# EAGLE design CubeSatPowerSupply (EAGLE 6.2)
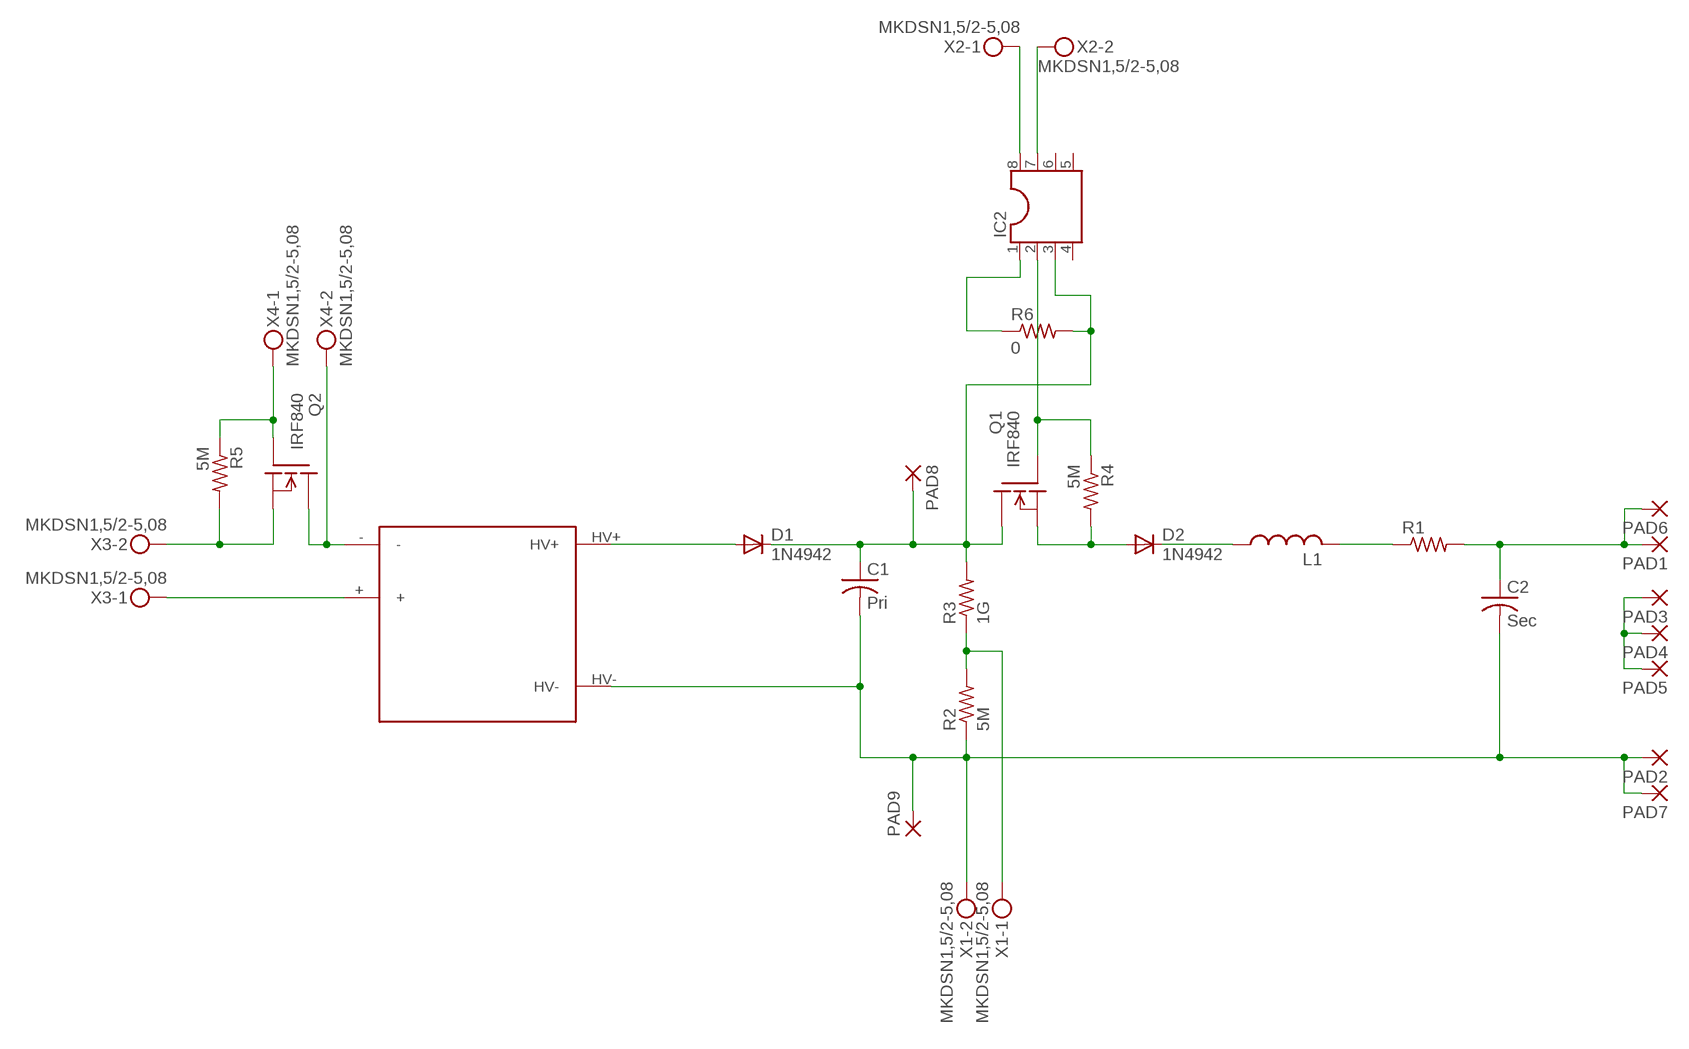
[diagram p0: schematic, sheet 1]

## Parts
C1  Pri  C-US325-182X374  [C325-182X374]
C2  Sec  C-US325-182X374  [C325-182X374]
D1  1N4942  [DO41-10]
D2  1N4942  [DO41-10]
IC2  DIL8  [DIL08]
L1  L-US0207/12  [0207/12]
PAD1  2,54/1,0  [2,54/1,0]
PAD2  2,54/1,0  [2,54/1,0]
PAD3  2,54/1,0  [2,54/1,0]
PAD4  2,54/1,0  [2,54/1,0]
PAD5  2,54/1,0  [2,54/1,0]
PAD6  2,54/1,0  [2,54/1,0]
PAD7  2,54/1,0  [2,54/1,0]
PAD8  2,54/1,0  [2,54/1,0]
PAD9  2,54/1,0  [2,54/1,0]
Q1  IRF840  [TO220]
Q2  IRF840  [TO220]
R1  R-US_0309/12  [0309/12]
R2  5M  R-US_0207/10  [0207/10]
R3  1G  R-US_0207/10  [0207/10]
R4  5M  R-US_0207/10  [0207/10]
R5  5M  R-US_0207/10  [0207/10]
R6  0  R-US_0207/10  [0207/10]
U$1  Q5  [Q5]
X1  MKDSN1,5/2-5,08  [MKDSN1,5/2-5,08]
X2  MKDSN1,5/2-5,08  [MKDSN1,5/2-5,08]
X3  MKDSN1,5/2-5,08  [MKDSN1,5/2-5,08]
X4  MKDSN1,5/2-5,08  [MKDSN1,5/2-5,08]

## Nets
N$1: L1.2 R1.1
N$2: D2.C L1.1
N$3: C2.1 PAD1.1(P) PAD6.1(P) R1.2
N$4: IC2.2 Q1.1(G) R4.1
N$5: D2.A Q1.3(S) R4.2
N$6: C1.1 D1.C IC2.3 PAD8.1(P) Q1.2(D) R3.2 R6.2
N$7: IC2.1 R6.1
N$8: Q2.1(G) R5.1 X4.1
N$10: D1.A U$1.HV+
N$11: R2.2 R3.1 X1.1
N$12: C1.2 C2.2 PAD2.1(P) PAD7.1(P) PAD9.1(P) R2.1 U$1.HV- X1.2
N$13: PAD3.1(P) PAD4.1(P) PAD5.1(P)
N$17: IC2.7 X2.2
N$18: IC2.8 X2.1
N$19: Q2.3(S) R5.2 X3.2
N$20: Q2.2(D) U$1.- X4.2
N$21: U$1.+ X3.1
Unconnected: IC2.4 IC2.5 IC2.6

## Library data of the parts
C1 C2 = rcl:C-US: CAPACITOR, American symbol
D1 D2 = diode:1N4942: DIODE 1.0 A, 200 V, 150 ns
IC2 = ic-package:DIL8: Dual In Line / Socket
L1 = rcl:L-US: INDUCTOR, American symbol
PAD1-PAD9 = wirepad:2,54/1,0: THROUGH-HOLE PAD
Q1 Q2 = transistor-fet:IRF840: N-Channel Enhancement MOSFET (HEXFET); 500V; 8A; 0,85Ohm
R1-R6 = rcl:R-US_: RESISTOR, American symbol
U$1 = CubeSat:Q5
X1-X4 = con-phoenix-508:MKDSN1,5/2-5,08: MKDSN 1,5/ 2-5,08 Printklemme Nennstrom: 13,5 A Nennspannung: 250 V Rastermaß: 5,08 mm Polzahl: 2 Anschlussart: Schraubanschluss Montage: Löten Anschlussrichtung Leiter/Platine: 0 ° Artikelnummer: 1729128 Source: http://eshop.phoenixcontact.com .. 1729128.pdf; MPN: MKDSN 1,5/2-5.08; OC_FARNELL: 1792903; OC_NEWARK: 30M2397

## Board
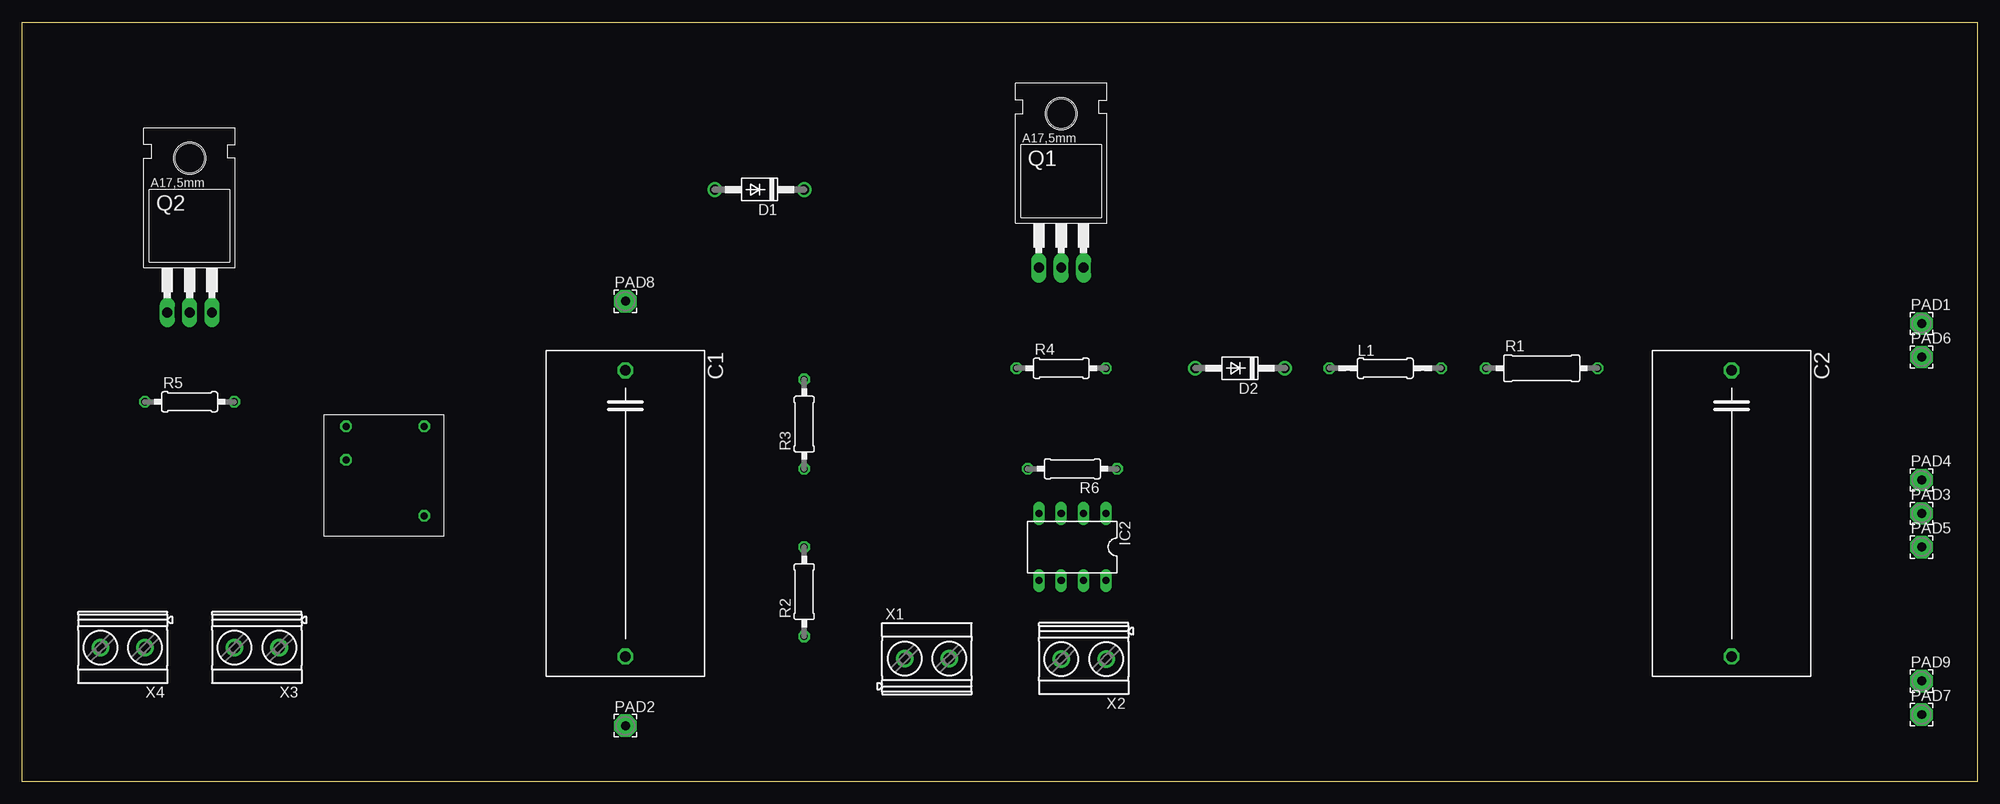
[diagram p1: board, top side]
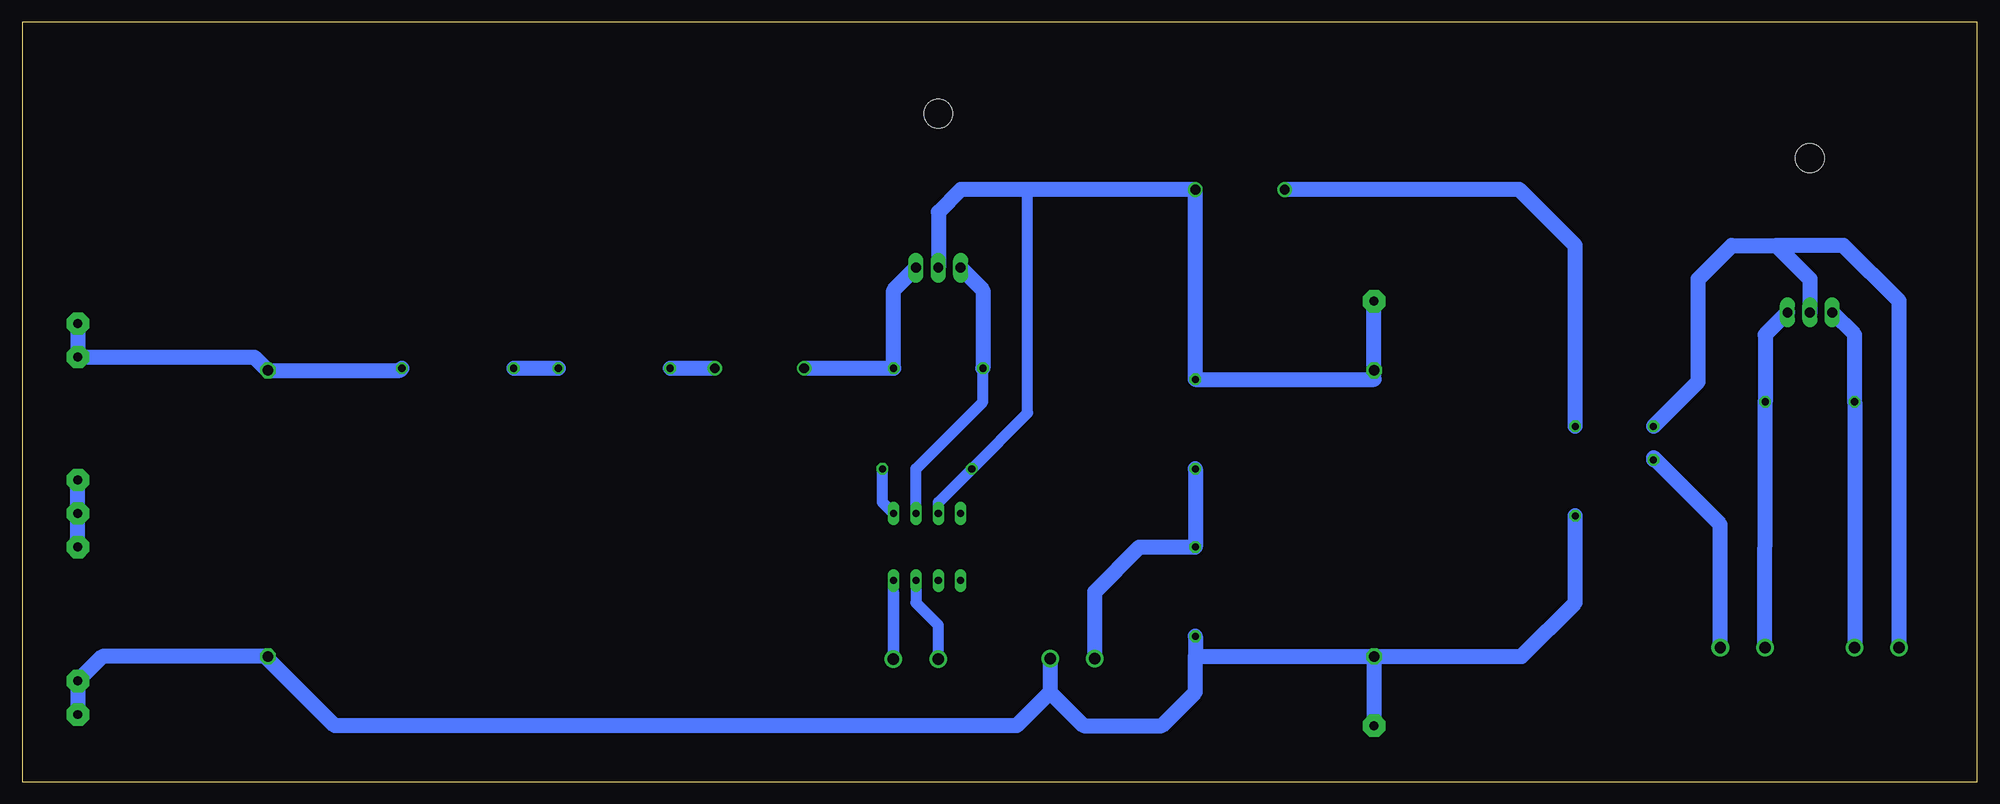
[diagram p2: board, bottom side, seen from below]

Size 222.25 x 86.36 mm. Coordinates in mm from the lower left corner, seen from the top.
Outline: 222.25,86.36 222.25,0 0,0 0,86.36 222.25,86.36
Copper layers (1*16): Top 0.035mm / dielectric 1.5mm / Bottom 0.035mm
Design rules: minimum track width 10mil, minimum drill 24mil, track to track 8mil, track to pad 8mil, pad to pad 8mil, via to via 8mil, smd to smd 8mil, copper to edge 40mil, drill to drill 8mil, minimum pad ring 10mil, minimum via ring 8mil, stop-mask expansion 4mil, vias tented up to drill 0mil, thermal gap 10mil

### Footprints (pad centres in the part's own frame; a part is rotated, then mirrored left to right if it is on the bottom)
C325-182X374 = drill 1.194 octagon: 1 -16.256,0; 2 16.256,0
DO41-10 = drill 1.118: A 5.08,0; C -5.08,0
DIL08 = drill 0.813 long: 1 -3.81,-3.81; 2 -1.27,-3.81; 3 1.27,-3.81; 4 3.81,-3.81; 5 3.81,3.81; 6 1.27,3.81; 7 -1.27,3.81; 8 -3.81,3.81
0207/12 = drill 0.813 octagon: 1 -6.35,0; 2 6.35,0
2,54/1,0 = drill 1.016 pad 2.54 octagon: 1 0,0
TO220 = drill 1.118 long: 1 -2.54,-6.35; 2 0,-6.35; 3 2.54,-6.35 | hole 3.302: 0,11.176
0309/12 = drill 0.813 octagon: 1 -6.35,0; 2 6.35,0
0207/10 = drill 0.813 octagon: 1 -5.08,0; 2 5.08,0
Q5 = drill 0.8 octagon: + 2.54,8.636; - 2.54,12.446; HV+ 11.43,12.446; HV- 11.43,2.286
MKDSN1,5/2-5,08 = drill 1.3 pad 2: 1 -2.561,0.025; 2 2.519,0.025

### Placement (x,y rotation side)
C1  68.58,30.48 270 top
C2  194.31,30.48 270 top
D1  83.82,67.31 180 top
D2  138.43,46.99 180 top
IC2  119.38,26.67 180 top
L1  154.94,46.99 0 top
PAD1  215.9,52.07 0 top
PAD2  68.58,6.35 0 top
PAD3  215.9,30.48 0 top
PAD4  215.9,34.29 0 top
PAD5  215.9,26.67 0 top
PAD6  215.9,48.26 0 top
PAD7  215.9,7.62 0 top
PAD8  68.58,54.61 0 top
PAD9  215.9,11.43 0 top
Q1  118.11,64.77 0 top
Q2  19.05,59.69 0 top
R1  172.72,46.99 0 top
R2  88.9,21.59 90 top
R3  88.9,40.64 90 top
R4  118.11,46.99 0 top
R5  19.05,43.18 0 top
R6  119.38,35.56 180 top
U$1  34.29,27.94 0 top
X1  102.87,13.97 0 top
X2  120.65,13.97 180 top
X3  26.67,15.24 180 top
X4  11.43,15.24 180 top

### Tracks (layer width: path | path; a pad name or v marks a point on that pad's centre or on a via)
N$1
  Bottom 1.676: R1.1 L1.2
N$2
  Bottom 1.676: L1.1 D2.C
N$3
  Bottom 1.676: PAD1.1 PAD6.1 195.83,48.26 C2.1 179.32,46.74 R1.2
N$4
  Bottom 1.27: R4.1 113.03,43.18 120.65,35.56 IC2.2
  Bottom 1.676: Q1.1 113.03,55.88 R4.1
N$5
  Bottom 1.676: D2.A R4.2 123.19,55.88 Q1.3
N$6
  Bottom 1.27: 107.95,67.31 107.95,41.91 R6.2 118.11,31.75 IC2.3
  Bottom 1.676: PAD8.1 C1.1 68.58,45.72 R3.2 D1.C 107.95,67.31 115.57,67.31 118.11,64.77 Q1.2
N$7
  Bottom 1.27: IC2.1 124.46,31.75 R6.1
N$8
  Bottom 1.676: Q2.1 13.97,50.8 R5.1 13.97,15.19 X4.1
N$10
  Bottom 1.676: U$1.HV+ 45.72,60.96 52.07,67.31 D1.A
N$11
  Bottom 1.676: R3.1 R2.2 95.25,26.67 100.33,21.59 100.33,14.02 X1.1
N$12
  Bottom 1.676: C1.2 PAD2.1 | R2.1 88.9,14.22 | 88.9,14.22 C1.2 | C1.2 51.82,14.22 45.72,20.32 U$1.HV- | PAD7.1 PAD9.1 213.11,14.22 C2.2 194.31,13.97 186.69,6.35 109.22,6.35 105.41,10.16 | X1.2 105.41,13.97 105.41,10.16 | 105.41,10.16 101.6,6.35 92.71,6.35 88.9,10.16 88.9,14.22
N$13
  Bottom 1.676: PAD5.1 PAD3.1 PAD4.1
N$17
  Bottom 1.27: IC2.7 120.65,20.32 118.13,17.8 X2.2
N$18
  Bottom 1.27: 123.21,21.57 X2.1 123.19,13.97 IC2.8
N$19
  Bottom 1.676: X3.2 24.13,38.1 R5.2 24.13,50.8 Q2.3
N$20
  Bottom 1.676: U$1.- 31.75,45.47 31.75,57.15 27.94,60.96 22.86,60.96 | 22.86,60.96 19.05,57.15 Q2.2 | X4.2 8.91,54.63 15.24,60.96 22.86,60.96
N$21
  Bottom 1.676: X3.1 29.23,29.23 36.83,36.83 U$1.+